# EAGLE design DronePwrCut (EAGLE 7.7.0)
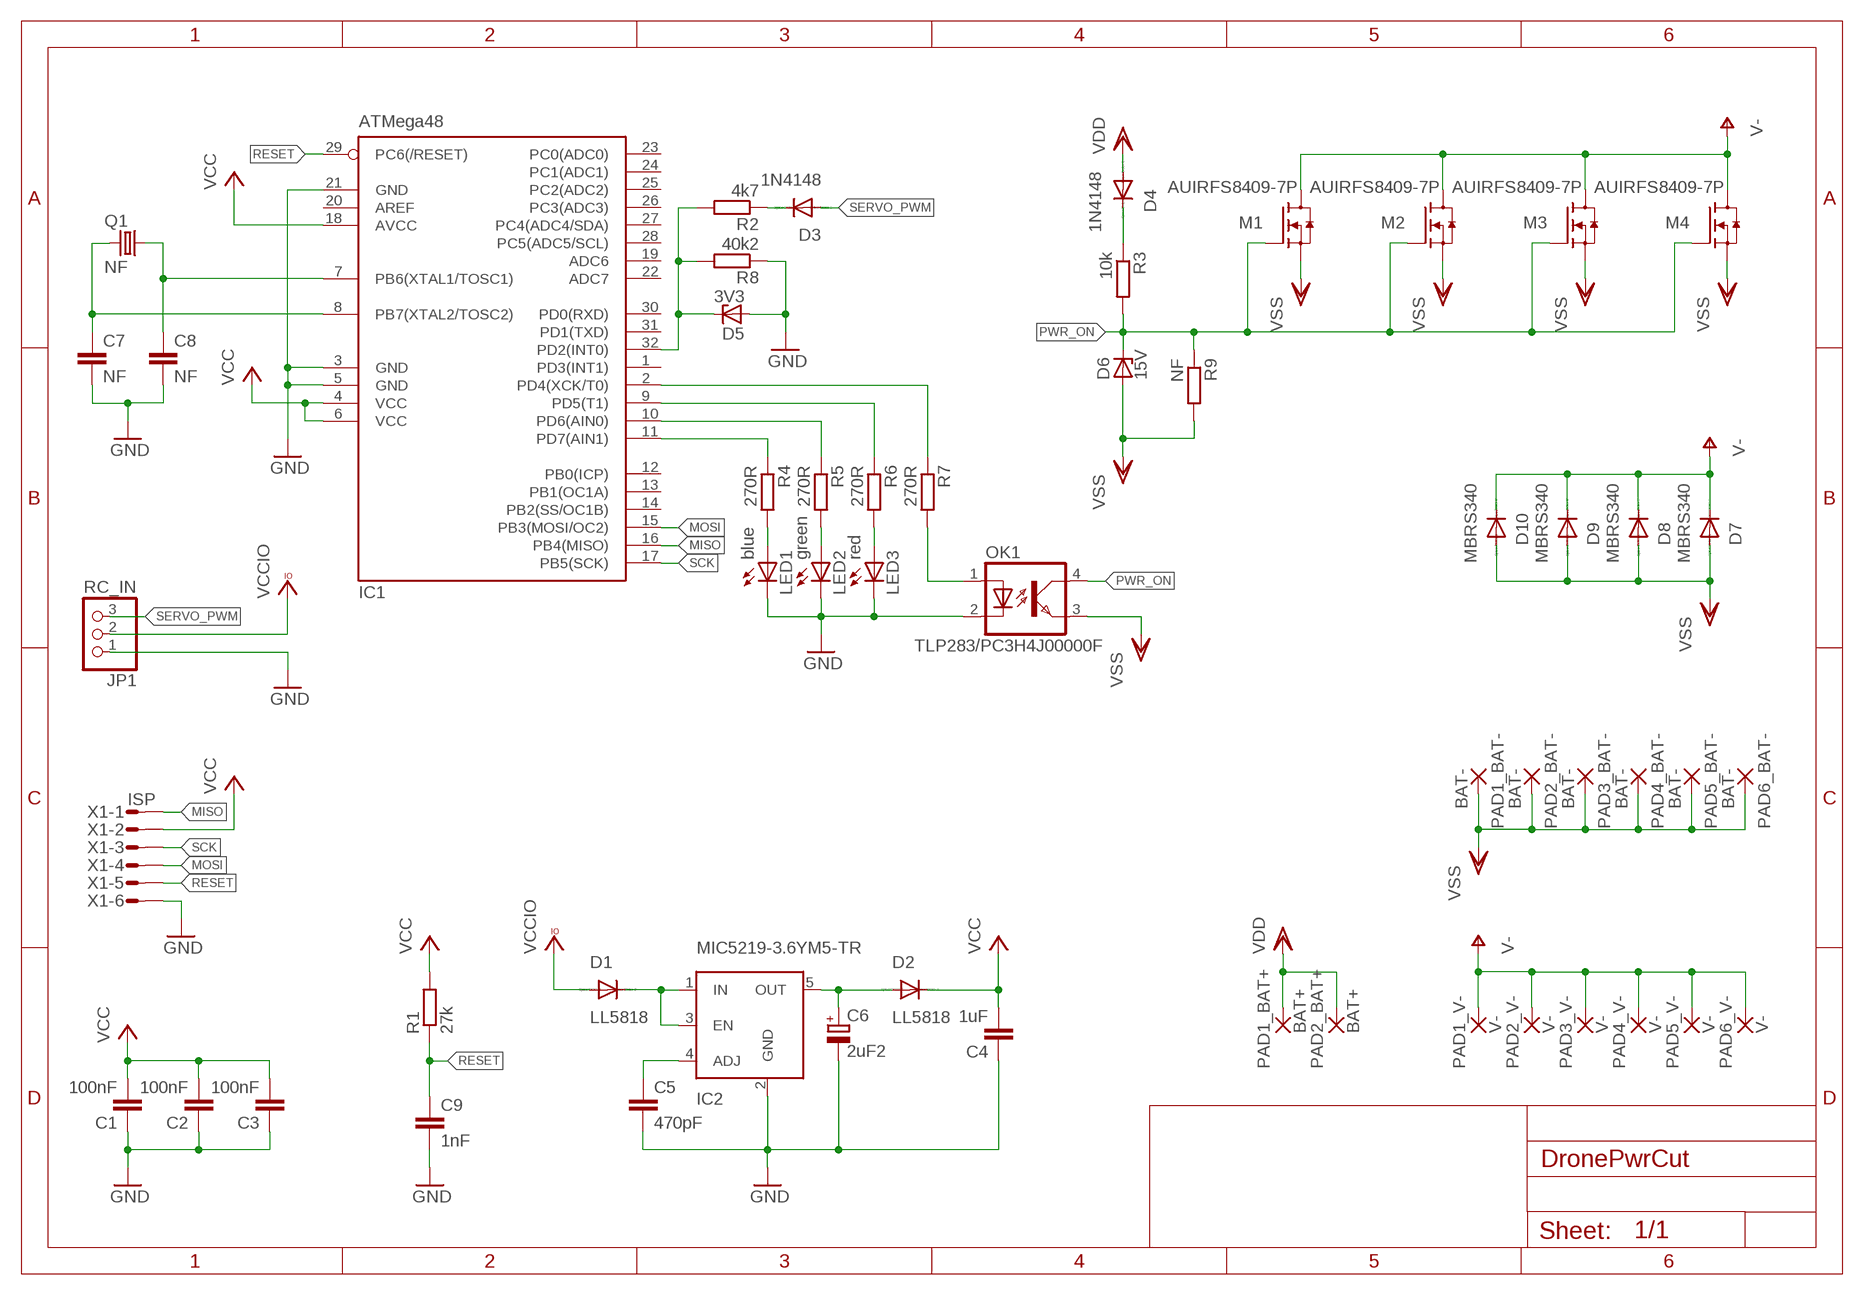
[diagram p0: schematic, sheet 1]

## Parts
C1  100nF  C-EUC1206K  [C1206K]
C2  100nF  C-EUC1206K  [C1206K]
C3  100nF  C-EUC1206K  [C1206K]
C4  1uF  C-EUC1206K  [C1206K]
C5  470pF  C-EUC1206K  [C1206K]
C6  2uF2  CPOL-EUSMCB  [SMC_B]
C7  NF  C-EUC1206K  [C1206K]
C8  NF  C-EUC1206K  [C1206K]
C9  1nF  C-EUC1206K  [C1206K]
D1  LL5818  DIODE-MELF-MLL41  [MELF-MLL41]
D2  LL5818  DIODE-MELF-MLL41  [MELF-MLL41]
D3  1N4148  DIODE-SOD80C  [SOD80C]
D4  1N4148  DIODE-SOD80C  [SOD80C]
D5  3V3  ZENER-DIODESOD80C  [SOD80C]
D6  15V  ZENER-DIODESOD80C  [SOD80C]
D7  MBRS340  DIODE-SMC  [SMC]
D8  MBRS340  DIODE-SMC  [SMC]
D9  MBRS340  DIODE-SMC  [SMC]
D10  MBRS340  DIODE-SMC  [SMC]
IC1  ATMega48  MEGA8-AI  [TQFP32-08]
IC2  MIC5219-3.6YM5-TR  MIC5219BM5  [SOT23-5]
JP1  RC_IN  PINHD-1X3  [1X03]
LED1  blue  LEDCHIPLED_1206  [CHIPLED_1206]
LED2  green  LEDCHIPLED_1206  [CHIPLED_1206]
LED3  red  LEDCHIPLED_1206  [CHIPLED_1206]
M1  AUIRFS8409-7P  [P-TO263-7-1]
M2  AUIRFS8409-7P  [P-TO263-7-1]
M3  AUIRFS8409-7P  [P-TO263-7-1]
M4  AUIRFS8409-7P  [P-TO263-7-1]
OK1  TLP283/PC3H4J00000F  TLP283  [MINI-FLAT-4]
PAD1_BAT+  BAT+  1,6/0,8  [1,6/0,8]
PAD1_BAT-  BAT-  1,6/0,8  [1,6/0,8]
PAD1_V-  V-  1,6/0,8  [1,6/0,8]
PAD2_BAT+  BAT+  1,6/0,8  [1,6/0,8]
PAD2_BAT-  BAT-  1,6/0,8  [1,6/0,8]
PAD2_V-  V-  1,6/0,8  [1,6/0,8]
PAD3_BAT-  BAT-  1,6/0,8  [1,6/0,8]
PAD3_V-  V-  1,6/0,8  [1,6/0,8]
PAD4_BAT-  BAT-  1,6/0,8  [1,6/0,8]
PAD4_V-  V-  1,6/0,8  [1,6/0,8]
PAD5_BAT-  BAT-  1,6/0,8  [1,6/0,8]
PAD5_V-  V-  1,6/0,8  [1,6/0,8]
PAD6_BAT-  BAT-  1,6/0,8  [1,6/0,8]
PAD6_V-  V-  1,6/0,8  [1,6/0,8]
Q1  NF  CRYSTALHC49UP  [HC49UP]
R1  27k  R-EU_R1206  [R1206]
R2  4k7  R-EU_R1206  [R1206]
R3  10k  R-EU_R1206  [R1206]
R4  270R  R-EU_R1206  [R1206]
R5  270R  R-EU_R1206  [R1206]
R6  270R  R-EU_R1206  [R1206]
R7  270R  R-EU_R1206  [R1206]
R8  40k2  R-EU_R1206  [R1206]
R9  NF  R-EU_R1206  [R1206]
X1  ISP  MICROMATCH-6  [MICROMATCH-6]

## Nets
GND: C1.1 C2.1 C3.1 C4.1 C5.2 C6.- C7.2 C8.2 C9.2 D5.A IC1.3(GND) IC1.5(GND) IC1.21(GND) IC2.2(GND) JP1.1 LED1.C LED2.C LED3.C OK1.2(C) R8.1 X1.6
MISO: IC1.16(PB4(MISO)) X1.1
MOSI: IC1.15(PB3(MOSI/OC2)) X1.4
N$1: C8.1 IC1.7(PB6(XTAL1/TOSC1)) Q1.1
N$2: C6.+ D2.A IC2.5(OUT)
N$3: C5.1 IC2.4(ADJ)
N$4: D1.C IC2.1(IN) IC2.3(EN)
N$5: C7.1 IC1.8(PB7(XTAL2/TOSC2)) Q1.2
N$6: D5.C IC1.32(PD2(INT0)) R2.2 R8.2
N$7: D3.C R2.1
N$8: D4.C R3.1
N$9: IC1.11(PD7(AIN1)) R4.1
N$10: IC1.10(PD6(AIN0)) R5.1
N$11: IC1.9(PD5(T1)) R6.1
N$12: IC1.2(PD4(XCK/T0)) R7.1
N$13: LED1.A R4.2
N$14: LED2.A R5.2
N$15: LED3.A R6.2
N$16: OK1.1(A) R7.2
PWR_ON: D6.C M1.1(G) M2.1(G) M3.1(G) M4.1(G) OK1.4(COL) R3.2 R9.1
RESET: C9.1 IC1.29(PC6(/RESET)) R1.1 X1.5
SCK: IC1.17(PB5(SCK)) X1.3
SERVO_PWM: D3.A JP1.3
V-: D7.C D8.C D9.C D10.C M1.7(D) M2.7(D) M3.7(D) M4.7(D) PAD1_V-.1(P) PAD2_V-.1(P) PAD3_V-.1(P) PAD4_V-.1(P) PAD5_V-.1(P) PAD6_V-.1(P)
VCC: C1.2 C2.2 C3.2 C4.2 D2.C IC1.4(VCC) IC1.6(VCC) IC1.18(AVCC) R1.2 X1.2
VCCIO: D1.A JP1.2
VDD: D4.A PAD1_BAT+.1(P) PAD2_BAT+.1(P)
VSS: D6.A D7.A D8.A D9.A D10.A M1.2(S) M1.3(S) M1.4(S) M1.5(S) M1.6(S) M2.2(S) M2.3(S) M2.4(S) M2.5(S) M2.6(S) M3.2(S) M3.3(S) M3.4(S) M3.5(S) M3.6(S) M4.2(S) M4.3(S) M4.4(S) M4.5(S) M4.6(S) OK1.3(EMIT) PAD1_BAT-.1(P) PAD2_BAT-.1(P) PAD3_BAT-.1(P) PAD4_BAT-.1(P) PAD5_BAT-.1(P) PAD6_BAT-.1(P) R9.2
Unconnected: IC1.1(PD3(INT1)) IC1.12(PB0(ICP)) IC1.13(PB1(OC1A)) IC1.14(PB2(SS/OC1B)) IC1.19(ADC6) IC1.20(AREF) IC1.22(ADC7) IC1.23(PC0(ADC0)) IC1.24(PC1(ADC1)) IC1.25(PC2(ADC2)) IC1.26(PC3(ADC3)) IC1.27(PC4(ADC4/SDA)) IC1.28(PC5(ADC5/SCL)) IC1.30(PD0(RXD)) IC1.31(PD1(TXD))

## Library data of the parts
C1-C5 C7-C9 = rcl:C-EU: CAPACITOR, European symbol
C6 = rcl:CPOL-EU: POLARIZED CAPACITOR, European symbol
D1-D4 D7-D10 = diode:DIODE-: DIODE
D5 D6 = diode:ZENER-DIODE: Z-Diode
IC1 = atmel:MEGA8: MICROCONTROLLER 8 Kbytes FLASH, 1 kbytes SRAM, 512 bytes EEPROM, USART, 6-channel 10 bit ADC, 2-channel 8 bit ADC Pin compatible with Atmega48, ATMega88, ATMega168 Source: avr.lbr; MPN: ATMEGA8-16AU; OC_FARNELL: 9171371; OC_NEWARK: 73M8863
IC2 = vario:MIC5219BM5: VOLTAGE REGULATOR; MF: ALTERA CORPORATION; MPN: MIC5219BM5 TR; OC_FARNELL: 1100656; OC_NEWARK: 09J8939
JP1 = pinhead:PINHD-1X3: PIN HEADER
LED1-LED3 = led:LED: LED OSRAM: - CHIPLED LG R971, LG N971, LY N971, LG Q971, LY Q971, LO R971, LY R971 LH N974, LH R974 LS Q976, LO Q976, LY Q976 LO Q996 - Hyper CHIPLED LW Q18S LB Q993, LB Q99A, LB R99A - SideLED LS A670, LO A670, LY A670, LG A670, LP A670 LB A673, LV A673, LT A673, LW A673 LH A674 LY A675 LS A676, LA A676, LO A676, LY A676, LW A676 LS A679, LY A679, LG A679 - Hyper Micro SIDELED® LS Y876, LA Y876, LO Y876, LY Y876 LT Y87S - SmartLED LW L88C, LW L88S LB L89C, LB L89S, LG L890 LS L89K, LO L89K, LY L89K LS L896, LA L896, LO L896, LY L896 - TOPLED LS T670, LO T670, LY T670, LG T670, LP T670 LSG T670, LSP T670, LSY T670, LOP T670, LYG T670 LG T671, LOG T671, LSG T671 LB T673, LV T673, LT T673, LW T673 LH T674 LS T676, LA T676, LO T676, LY T676, LB T676, LH T676, LSB T676, LW T676 LB T67C, LV T67C, LT T67C, LS T67K, LO T67K, LY T67K, LW E67C LS E67B, LA E67B, LO E67B, LY E67B, LB E67C, LV E67C, LT E67C LW T67C LS T679, LY T679, LG T679 LS T770, LO T770, LY T770, LG T770, LP T770 LB T773, LV T773, LT T773, LW T773 LH T774 LS E675, LA E675, LY E675, LS T675 LS T776, LA T776, LO T776, LY T776, LB T776 LHGB T686 LT T68C, LB T68C - Hyper Mini TOPLED® LB M676 - Mini TOPLED Santana® LG M470 LS M47K, LO M47K, LY M47K Source: http://www.osram.convergy.de LUXEON: - LUMILED® LXK2-PW12-R00, LXK2-PW12-S00, LXK2-PW14-U00, LXK2-PW14-V00 LXK2-PM12-R00, LXK2-PM12-S00, LXK2-PM14-U00 LXK2-PE12-Q00, LXK2-PE12-R00, LXK2-PE12-S00, LXK2-PE14-T00, LXK2-PE14-U00 LXK2-PB12-K00, LXK2-PB12-L00, LXK2-PB12-M00, LXK2-PB14-N00, LXK2-PB14-P00, LXK2-PB14-Q00 LXK2-PR12-L00, LXK2-PR12-M00, LXK2-PR14-Q00, LXK2-PR14-R00 LXK2-PD12-Q00, LXK2-PD12-R00, LXK2-PD12-S00 LXK2-PH12-R00, LXK2-PH12-S00 LXK2-PL12-P00, LXK2-PL12-Q00, LXK2-PL12-R00 Source: www.luxeon.com KINGBRIGHT: KA-3528ASYC Source: www.kingbright.com
M1-M4 = mylib:AUIRFS8409-7P: HEXFET® Power MOSFET AUIRFS8409-7P
OK1 = optocoupler:TLP283: TOSHIBA PHOTOCOUPLER GaAs IRED & PHOTO-TRANSISTOR Source: http://www.semicon.toshiba.co.jp/td/en/Opto/Photocoupler/en_20050928_TLP283_datasheet.pdf; OC_FARNELL: unknown; OC_NEWARK: unknown
PAD1_BAT+ PAD1_BAT- PAD1_V- PAD2_BAT+ PAD2_BAT- PAD2_V- PAD3_BAT- PAD3_V- PAD4_BAT- PAD4_V- PAD5_BAT- PAD5_V- PAD6_BAT- PAD6_V- = wirepad:1,6/0,8: THROUGH-HOLE PAD
Q1 = crystal:CRYSTAL: CRYSTAL; OC_FARNELL: unknown; OC_NEWARK: unknown
R1-R9 = rcl:R-EU_: RESISTOR, European symbol
X1 = con-amp-micromatch:MICROMATCH-6: MicroMaTch 6 7-215464-6 / 0-215464-6 Drawing Number C-215464 DDEController.pdf; MPN: 7-215464-6; OC_FARNELL: 3784630; OC_NEWARK: 19R8125

## Board
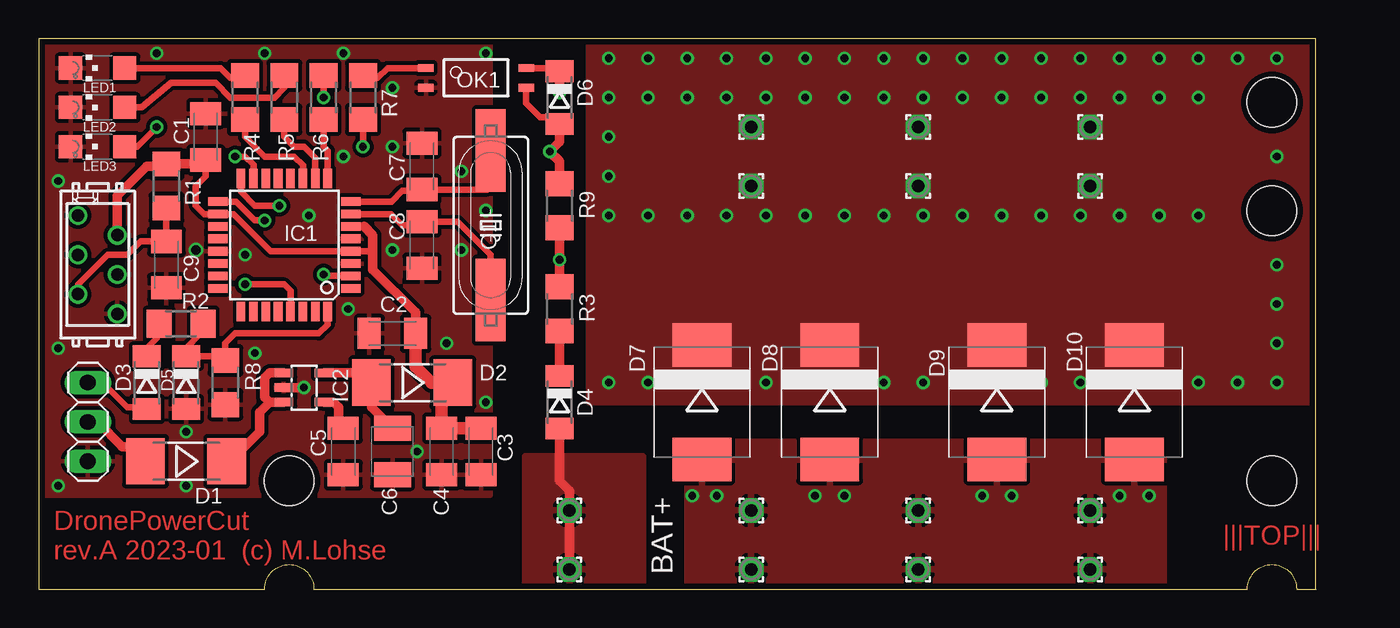
[diagram p1: board, top side]
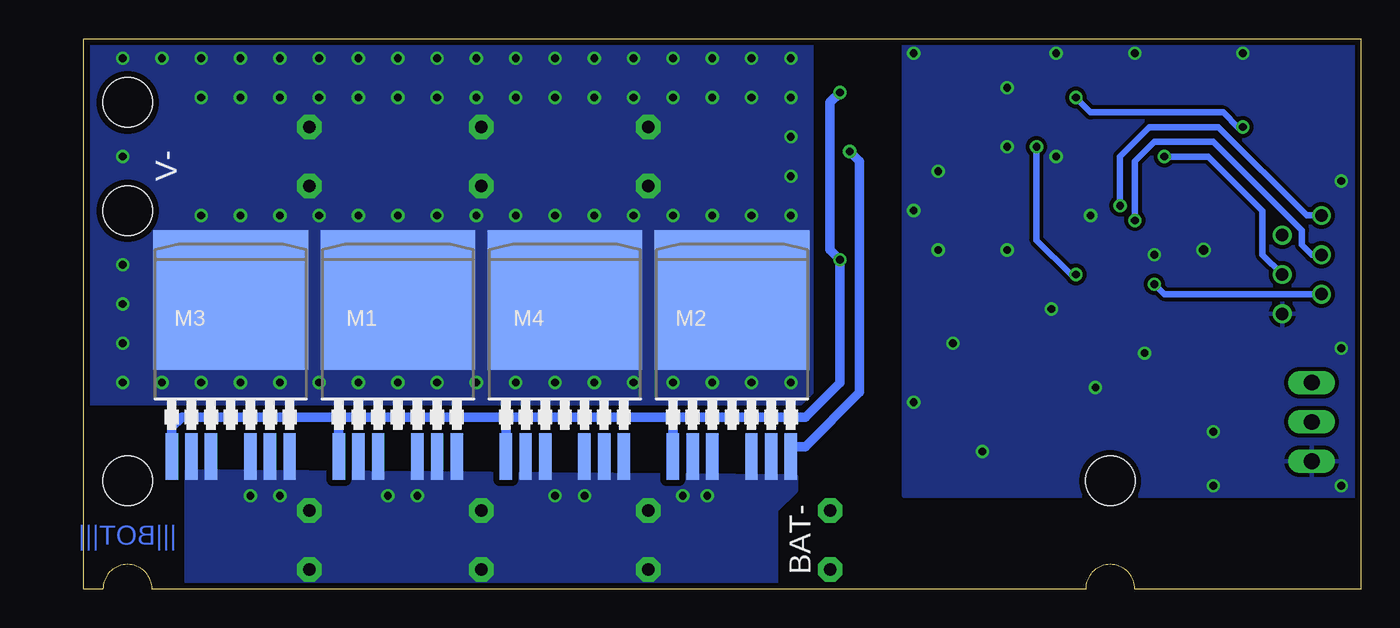
[diagram p2: board, bottom side, seen from below]

Size 82.55 x 35.55 mm. Coordinates in mm from the lower left corner, seen from the top.
Outline: 82.54,0 82.54,35.55 0,35.55 0,0 14.61,0 arc-90 16.19,1.59 arc-90 17.78,0 78.11,0 arc-90 79.69,1.59 arc-90 81.28,0 82.55,0
Copper layers (1*16): Top 0.0356mm / dielectric 1.5011mm / Bottom 0.0356mm
Design rules "LaenPCBOrder": minimum track width 6mil, minimum drill 13mil, track to track 6mil, track to pad 6mil, pad to pad 6mil, via to via 6mil, smd to smd 6mil, copper to edge 15mil, drill to drill 6mil, minimum pad ring 7mil, minimum via ring 7mil, stop-mask expansion 3mil, vias tented up to drill 0mil, thermal gap 10mil
Holes 3.2 mm at 79.69,6.99 16.19,6.99 79.69,31.43 79.69,24.45

### Footprints (pad centres in the part's own frame; a part is rotated, then mirrored left to right if it is on the bottom)
C1206K = smd 1.5 x 2: 1 -1.5,0; 2 1.5,0
SMC_B = smd 1.6 x 2.4: + -1.5,0; - 1.5,0
MELF-MLL41 = smd 2.5 x 3: A 2.625,0; C -2.625,0
SOD80C = smd 1.4 x 1.8: A 1.7,0; C -1.7,0
SMC = smd 2.8 x 3.8: A 3.7,0; C -3.7,0
TQFP32-08 = smd 1.27 x 0.559: 1 -4.293,2.8; 2 -4.293,2; 3 -4.293,1.2; 4 -4.293,0.4; 5 -4.293,-0.4; 6 -4.293,-1.2; 7 -4.293,-2; 8 -4.293,-2.8; 17 4.293,-2.8; 18 4.293,-2; 19 4.293,-1.2; 20 4.293,-0.4; 21 4.293,0.4; 22 4.293,1.2; 23 4.293,2; 24 4.293,2.8 | smd 0.559 x 1.27: 9 -2.8,-4.293; 10 -2,-4.293; 11 -1.2,-4.293; 12 -0.4,-4.293; 13 0.4,-4.293; 14 1.2,-4.293; 15 2,-4.293; 16 2.8,-4.293; 25 2.8,4.293; 26 2,4.293; 27 1.2,4.293; 28 0.4,4.293; 29 -0.4,4.293; 30 -1.2,4.293; 31 -2,4.293; 32 -2.8,4.293
SOT23-5 = smd 0.55 x 1.2: 1 -0.95,-1.3; 2 0,-1.3; 3 0.95,-1.3; 4 0.95,1.3; 5 -0.95,1.3
1X03 = drill 1.016 long: 1 -2.54,0; 2 0,0; 3 2.54,0
CHIPLED_1206 = smd 1.5 x 1.5: A 0,-1.75; C 0,1.75
P-TO263-7-1 = smd 0.8 x 3: 1 -3.81,-9.207; 2 -2.54,-9.207; 3 -1.27,-9.207; 4 1.27,-9.207; 5 2.54,-9.207; 6 3.81,-9.207 | smd 10 x 9: 7 0,0.895
MINI-FLAT-4 = smd 1 x 0.5: 1 -3.24,0.635; 2 -3.24,-0.635; 3 3.24,-0.635; 4 3.24,0.635
1,6/0,8 = drill 0.813 pad 1.6 octagon: 1 0,0
HC49UP = smd 5.334 x 1.93: 1 -4.826,0; 2 4.826,0
R1206 = smd 1.6 x 1.803: 1 -1.422,0; 2 1.422,0
MICROMATCH-6 = drill 0.813: 1 3.175,1.27; 2 1.905,-1.27; 3 0.635,1.27; 4 -0.635,-1.27; 5 -1.905,1.27; 6 -3.175,-1.27

### Placement (x,y rotation side)
C1  10.79,29.21 270 top
C2  22.86,16.51 0 top
C3  28.57,8.89 90 top
C4  26.04,8.89 90 top
C5  19.68,8.89 270 top
C6  22.86,8.89 270 top
C7  24.77,27.3 90 top
C8  24.77,22.23 270 top
C9  8.26,20.95 270 top
D1  9.53,8.26 180 top
D2  24.13,13.34 180 top
D3  6.99,13.34 270 top
D4  33.66,12.06 270 top
D5  9.53,13.34 270 top
D6  33.66,31.75 270 top
D7  42.86,12.06 270 top
D8  70.8,12.06 270 top
D9  61.91,12.06 270 top
D10  51.12,12.06 270 top
IC1  15.88,22.23 180 top
IC2  17.14,13.02 270 top
JP1  3.17,10.79 90 top
LED1  3.81,33.66 90 top
LED2  3.81,31.11 90 top
LED3  3.81,28.57 90 top
M1  62.23,17.78 0 bottom
M2  40.64,17.78 0 bottom
M3  73.03,17.78 0 bottom
M4  51.44,17.78 0 bottom
OK1  28.26,33.02 0 top
PAD1_BAT+  34.29,5.08 0 top
PAD1_BAT-  67.94,5.08 0 top
PAD1_V-  67.94,29.84 0 top
PAD2_BAT+  34.29,1.27 0 top
PAD2_BAT-  67.94,1.27 0 top
PAD2_V-  67.94,26.04 0 top
PAD3_BAT-  56.83,5.08 0 top
PAD3_V-  56.83,29.84 0 top
PAD4_BAT-  56.83,1.27 0 top
PAD4_V-  56.83,26.04 0 top
PAD5_BAT-  46.04,5.08 0 top
PAD5_V-  46.04,29.84 0 top
PAD6_BAT-  46.04,1.27 0 top
PAD6_V-  46.04,26.04 0 top
Q1  29.21,23.5 90 top
R1  8.26,26.04 90 top
R2  9.21,17.14 0 top
R3  33.66,18.1 90 top
R4  13.34,31.75 90 top
R5  15.88,31.75 90 top
R6  18.41,31.75 90 top
R7  20.95,31.75 90 top
R8  12.06,13.34 90 top
R9  33.66,24.77 90 top
X1  3.81,20.95 90 top

### Tracks (layer width: path | path; a pad name or v marks a point on that pad's centre or on a via)
GND  (via drill 0.5, 0.6)
  Top 0.61: IC2.2 16.83,13.02
  other vias: 17.46,24.13 13.34,21.59 22.86,28.57 19.68,27.94 1.27,26.35 9.53,10.16 22.86,21.91 24.45,8.89 20,18.1 1.27,6.67 1.27,15.56 7.62,34.61 28.89,34.61 27.3,21.91 10.16,21.91 14.61,34.61 19.68,34.61 28.89,12.06 28.89,24.45 9.53,6.67 17.14,13.02 26.35,15.88 13.97,15.24 27.3,26.99 22.86,32.38
  pour Bottom (isolate 0.254): 0.32,35.24 0.32,6.03 29.53,6.03 29.53,35.24
  pour Top (isolate 0.254): 0.32,35.24 0.32,6.03 29.21,6.03 29.21,35.24
MISO  (via drill 0.5)
  Top 0.406: IC1.16 13.07,25.66 13.97,24.77 v15.56,24.77
  Bottom 0.406: X1.1 3.49,24.13 9.21,29.84 13.65,29.84 15.56,27.94 v15.56,24.77
MOSI  (via drill 0.5)
  Top 0.406: IC1.15 13.88,27.4 13.34,27.94 v12.7,27.94
  Bottom 0.406: X1.4 6.35,21.59 6.35,24.45 9.84,27.94 v12.7,27.94
N$1
  Top 0.406: IC1.7 22.77,24.23 23.5,23.5 24.54,23.5 C8.1 27.07,23.73 29.21,21.59 Q1.1
N$2
  Top 0.61: IC2.5 20.87,13.97 D2.A 21.5,11.74 C6.+
N$3
  Top 0.61: IC2.4 19.05,12.07 19.37,11.75 19.37,10.71 C5.1
N$4
  Top 0.406: IC2.3
  Top 0.61: D1.C 12.38,8.26 14.29,10.16 14.29,11.43 14.92,12.06 | 14.92,12.06 IC2.3 | IC2.1 14.92,13.97 14.61,13.65 14.61,12.38 14.92,12.06
N$5
  Top 0.406: IC1.8 22.8,25.02 23.5,25.72 24.68,25.72 C7.1 28.98,25.8 29.21,26.04 Q1.2
N$6
  Top 0.406: IC1.32 18.68,17.09 18.1,16.51 12.7,16.51 12.06,15.88 R8.2 11.79,15.04 D5.C 9.53,15.56 10.48,16.51 10.48,16.99 R2.2
N$7
  Top 0.406: D3.C 6.99,15.56 7.62,16.19 7.62,16.98 R2.1
N$8
  Top 0.61: D4.C R3.1
N$9
  Top 0.406: IC1.11 17.07,27.38 16.51,27.94 14.61,27.94 13.34,29.21 R4.1
N$10
  Top 0.406: IC1.10 17.88,27.84 17.14,28.57 16.51,28.57 15.88,29.21 R5.1
N$11
  Top 0.406: IC1.9 18.68,28.32 18.41,28.57 R6.1
N$12  (via drill 0.5)
  Top 0.406: IC1.2 18.64,20.23 v18.41,20.32 | v20.95,28.57 R7.1
  Bottom 0.406: v18.41,20.32 18.73,20.32 20.95,22.54 v20.95,28.57
N$13
  Top 0.406: LED1.A 11.75,33.66 12.38,33.02 13.18,33.02 R4.2
N$14
  Top 0.406: LED2.A 6.67,31.11 8.57,32.7 11.43,32.7 12.38,31.75 15.24,31.75 15.88,32.38 R5.2
N$15  (via drill 0.5)
  Top 0.406: LED3.A 6.35,28.57 v7.62,29.84 | v18.41,31.75 R6.2
  Bottom 0.406: v7.62,29.84 7.94,29.84 8.89,30.8 17.46,30.8 v18.41,31.75
N$16
  Top 0.406: OK1.1 22.54,33.66 21.91,33.02 21.11,33.02 R7.2
PWR_ON  (via drill 0.5)
  Top 0.406: OK1.4 33.45,33.66 D6.C
  Top 0.61: R3.2 v33.66,21.27 R9.1 | D6.C v33.66,32.07
  Bottom 0.61: 44.45,11.11 35.88,11.11 33.66,13.34 v33.66,21.27 34.29,21.91 34.29,31.43 v33.66,32.07 | 44.45,11.11 55.24,11.11 | M4.1 55.24,11.11 | M2.1 44.45,11.11 | 55.24,11.11 66.04,11.11 | 66.04,11.11 76.2,11.11 76.83,10.48 M3.1 | M1.1 66.04,11.11
RESET  (via drill 0.5)
  Top 0.406: IC1.29 16.27,19.29 15.88,19.68 v13.34,19.68 | X1.5 2.54,19.68 4.45,21.59 5.71,21.59 6.58,22.45 C9.1 R1.1
  Bottom 0.406: v13.34,19.68 12.7,19.05 X1.5
SCK  (via drill 0.5)
  Top 0.406: IC1.17 12.76,25.02 13.97,23.81 v14.61,23.81
  Bottom 0.406: X1.3 3.17,21.59 3.81,22.23 3.81,23.18 9.53,28.89 13.34,28.89 14.61,27.62 v14.61,23.81
SERVO_PWM
  Top 0.406: JP1.3 4.13,13.34 5.71,11.75 6.87,11.75 D3.A
V-  (via drill 0.5)
  other vias: 36.83,34.29 39.37,34.29 41.91,34.29 44.45,34.29 46.99,34.29 49.53,34.29 52.07,34.29 54.61,34.29 57.15,34.29 59.69,34.29 62.23,34.29 64.77,34.29 67.31,34.29 69.85,34.29 72.39,34.29 74.93,34.29 77.47,34.29 80.01,34.29 36.83,31.75 39.37,31.75 41.91,31.75 44.45,31.75 46.99,31.75 49.53,31.75 52.07,31.75 54.61,31.75 57.15,31.75 59.69,31.75 62.23,31.75 64.77,31.75 67.31,31.75 69.85,31.75 72.39,31.75 74.93,31.75 74.93,13.34 39.37,13.34 46.99,24.13 41.91,13.34 36.83,24.13 36.83,13.34 39.37,24.13 41.91,24.13 44.45,24.13 54.61,13.34 64.77,13.34 49.53,24.13 44.45,13.34 46.99,13.34 49.53,13.34 52.07,13.34 57.15,13.34 62.23,13.34 57.15,24.13 52.07,24.13 59.69,24.13 54.61,24.13 67.31,24.13 72.39,24.13 64.77,24.13 80.01,15.88 62.23,24.13 80.01,27.94 74.93,24.13 72.39,13.34 80.01,20.95 36.83,29.21 67.31,13.34 69.85,13.34 69.85,24.13 59.69,13.34 80.01,18.41 36.83,26.67 80.01,13.34 77.47,13.34
  pour Bottom (isolate 0.406, no thermals): 82.23,35.24 35.56,35.24 35.56,12.06 82.23,12.06
  pour Top (isolate 0.254, no thermals): 35.56,35.24 35.56,12.06 82.23,12.06 82.23,35.24
VCC
  Top 0.406: 20.1,23.5 IC1.6 21.02,23.43 | 8.1,27.3 R1.2 | 10.54,27.46 C1.2 10.79,26.67 10.16,26.04 10.16,24.77 10.7,24.23 IC1.18 12.61,24.23 15.01,21.82 IC1.4 21.67,21.82 21.59,21.91
  Top 0.61: 26.04,12.62 D2.C | X1.2 5.08,25.4 6.99,27.3 8.1,27.3 | R1.2 10.54,27.46 | C2.2 24.36,17.87 21.59,20.64 21.59,21.91 21.59,22.86 21.02,23.43
  Top 0.813: C2.2 24.36,14.38 25.4,13.34 D2.C | C3.2 C4.2 26.04,12.62
VCCIO
  Top 0.61: JP1.2 3.81,10.79 5.4,9.21 5.95,9.21 D1.A
VDD
  Top 0.61: D4.A 33.66,6.99 34.29,6.35 PAD1_BAT+.1 PAD2_BAT+.1
  pour Top (isolate 0.254): 31.43,8.57 31.43,0.32 39.05,0.32 39.05,8.57
VSS  (via drill 0.5)
  Top 0.406: OK1.3 31.5,31.37 32.38,30.48 33.23,30.48 D6.A
  Top 0.61: D6.A 33.66,28.89 v33.02,28.26 33.66,27.62 R9.2
  Bottom 0.61: v33.02,28.26 32.38,27.62 32.38,12.7 35.88,9.21 36.83,9.21 M2.6
  other vias: 42.23,6.03 43.81,6.03 50.16,6.03 52.07,6.03 60.96,6.03 62.87,6.03 69.85,6.03 71.75,6.03
  pour Bottom (isolate 0.406, no thermals): 36.51,7.3 36.51,6.35 37.78,5.08 37.78,0.32 75.88,0.32 75.88,7.62
  pour Top (isolate 0.254): 41.91,9.53 41.91,0.32 72.71,0.32 72.71,9.53

### Text on the board
Top: |||TOP||| | DronePowerCut / rev.A 2023-01 (c) M.Lohse
Bottom: |||BOT|||
tNames: BAT+
bNames: V- | BAT-
tStop: DronePowerCut / rev.A 2023-01 (c) M.Lohse